# Altium schematic sheet Controller_final.SchDoc
size 594 x 420 mm; SheetNumber: 1; SheetTotal: 5
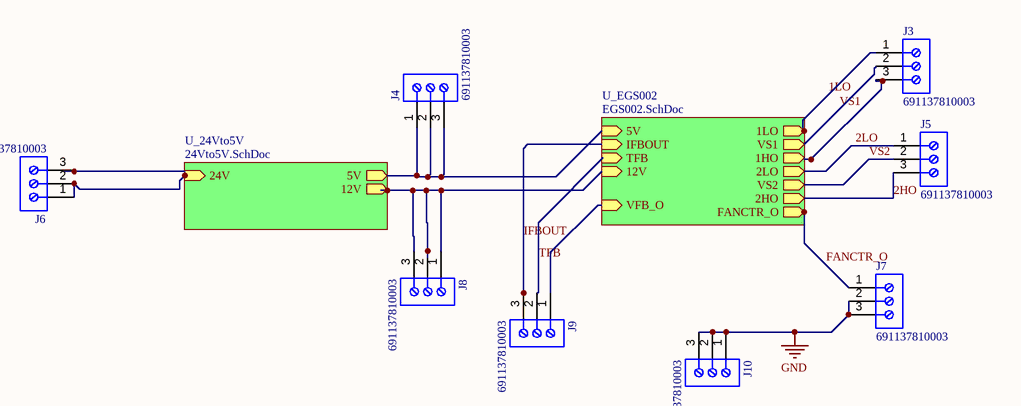
[diagram p0: Controller_final.SchDoc]

## Parts
J3  691137810003  [691137810003]
J4  691137810003  [691137810003]
J5  691137810003  [691137810003]
J6  691137810003  [691137810003]
J7  691137810003  [691137810003]
J8  691137810003  [691137810003]
J9  691137810003  [691137810003]
J10  691137810003  [691137810003]

## Sub-sheets
U_24Vto5V = 24Vto5V.SchDoc: 5V (out), 12V (out), 24V (in)
U_EGS002 = EGS002.SchDoc: 5V (in), IFBOUT (in), 1LO (out), VS1 (out), 1HO (out), TFB (in), 2LO (out), VS2 (out), 2HO (out), 12V (in), FANCTR_O (out), VFB_O (in)

## Nets
GND: J7.2 J7.3 J10.1 J10.2 J10.3
1LO: J3.1 ; sheet U_EGS002/1LO
2HO: J5.3 ; sheet U_EGS002/2HO
2LO: J5.1 ; sheet U_EGS002/2LO
FANCTR_O: J7.1 ; sheet U_EGS002/FANCTR_O
IFBOUT: J9.3 ; sheet U_EGS002/IFBOUT
TFB: J9.2 ; sheet U_EGS002/TFB
VS1: J3.2 ; sheet U_EGS002/VS1
VS2: J5.2 ; sheet U_EGS002/VS2
NetJ3_3: J3.3 ; sheet U_EGS002/1HO
NetJ4_1: J4.1 J4.2 J4.3 ; sheet U_24Vto5V/5V, sheet U_EGS002/5V
NetJ6_1: J6.1 J6.2 J6.3 ; sheet U_24Vto5V/24V
NetJ8_1: J8.1 J8.2 J8.3 ; sheet U_24Vto5V/12V, sheet U_EGS002/12V
NetJ9_1: J9.1 ; sheet U_EGS002/VFB_O

## Notes on the sheet
- DWG NO:
- REV:
- THIS DOCUMENT AND THE DATA DISCLOSED HEREIN OR
- HEREWITH IS THE PROPERTY OF ALTIUM LIMITED AND MAY
- BE FREELY DISTRIBUTED IN WHOLE. NO RIGHTS ARE
- RESERVED OR EXPRESS OR IMPLIED WARANTEE GIVEN.
- REVISION
- DESCRIPTION
- DATE
- APPROVED
- ENG:
- APPROVALS
- PROJECT
- DSN:
- CHK:
- REFERENCE DOCUMENTS
- PROJECT REVISION:
- TITLE
- DOCUMENT REVISION:
- DESIGN ITEM:
- BOM:
- FAB DWG:
- PCB DWG:
- ASSY DWG:
- SCALE:
- A2
- SIZE
- CAGE CODE
- FILE NAME
- DWG NO.
- SHEET
- OF
- REV

## Library data of the parts
J3-J10 = CMP-1502-03382-3: 10.00 mm Terminal Block, Horizontal Entr